# Altium project Copy of MB1363.PrjPcb (part 2 of 2)

## Sheet Copy of MCU_144_POWER.SchDoc: MCU 144 POWER
size A4; Date: Not used; ApprovedBy: Not used; CheckedBy: Not used; Author: Not used; CompanyName: STMicroelectronics; DrawnBy: Not used; Engineer: Not used; Organization: Not used; Address1: Not used; Address2: Not used; Address3: Not used; Address4: Not used; DocumentNumber: 4; Revision: Not used; SheetNumber: 4; SheetTotal: 9; CurrentTime: Not used; CurrentDate: Not used; Time: Not used; DocumentFullPathAndName: Not used; DocumentName: Not used; ModifiedDate: Not used; ImagePath: Not used; ProjectName: Not used; Application_BuildNumber: Not used
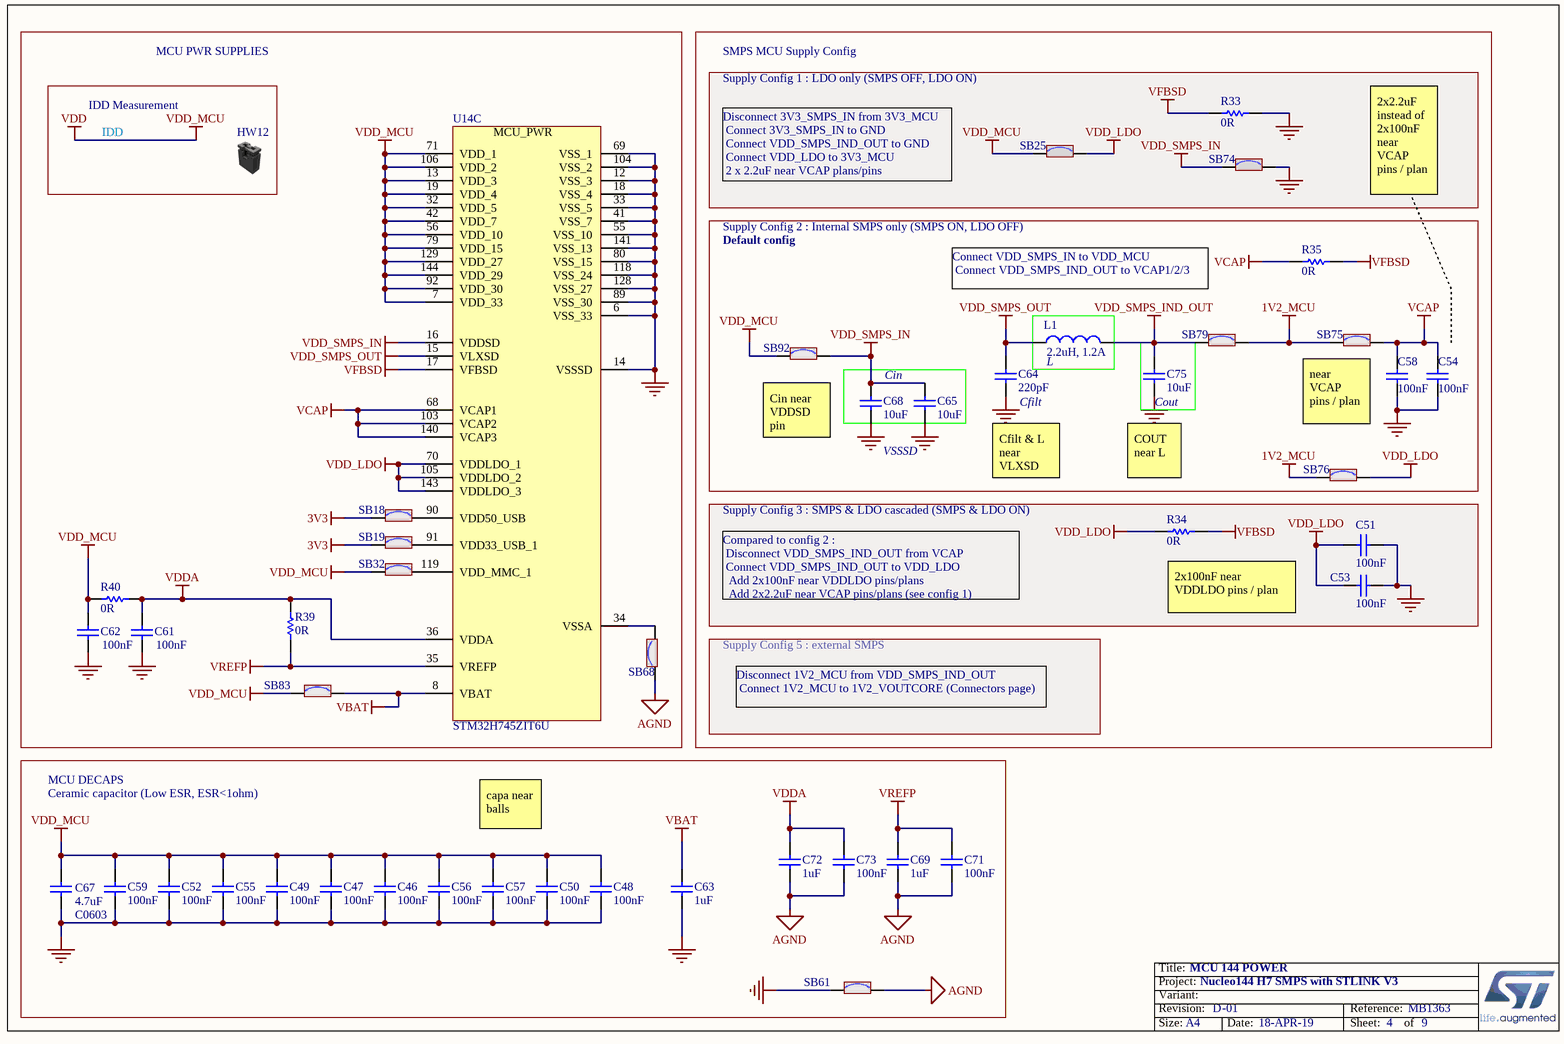
[diagram p5: Copy of MCU_144_POWER.SchDoc]

### Parts
C46  value 100nF  [C0402]  (hidden comment: Capacitor)
C47  value 100nF  [C0402]  (hidden comment: Capacitor)
C48  value 100nF  [C0402]  (hidden comment: Capacitor)
C49  value 100nF  [C0402]  (hidden comment: Capacitor)
C50  value 100nF  [C0402]  (hidden comment: Capacitor)
C51  value 100nF  [C0402]  (hidden comment: Capacitor)
C52  value 100nF  [C0402]  (hidden comment: Capacitor)
C53  value 100nF  [C0402]  (hidden comment: Capacitor)
C54  value 100nF  [C0402]  (hidden comment: Capacitor)
C55  value 100nF  [C0402]  (hidden comment: Capacitor)
C56  value 100nF  [C0402]  (hidden comment: Capacitor)
C57  value 100nF  [C0402]  (hidden comment: Capacitor)
C58  value 100nF  [C0402]  (hidden comment: Capacitor)
C59  value 100nF  [C0402]  (hidden comment: Capacitor)
C61  value 100nF  [C0402]  (hidden comment: Capacitor)
C62  value 100nF  [C0402]  (hidden comment: Capacitor)
C63  value 1uF  [C0603]  (hidden comment: Capacitor)
C64  value 220pF  [C0402]  (hidden comment: Capacitor)
C65  value 10uF  [C0402]  (hidden comment: Capacitor)
C67  value 4.7uF  [C0603]  (hidden comment: Capacitor)
C68  value 10uF  [C0402]  (hidden comment: Capacitor)
C69  value 1uF  [C0603]  (hidden comment: Capacitor)
C71  value 100nF  [C0402]  (hidden comment: Capacitor)
C72  value 1uF  [C0603]  (hidden comment: Capacitor)
C73  value 100nF  [C0402]  (hidden comment: Capacitor)
C75  value 10uF  [C0603]  (hidden comment: Capacitor)
HW12  Shunt Black 2.54mm  (value not drawn)  (mechanical)
L1  value 2.2uH, 1.2A  [L0805_H0P9]  (hidden comment: Inductor)
R33  value 0R  [R0402]  (hidden comment: Resistor)
R34  value 0R  [R0402]  (hidden comment: Resistor)
R35  value 0R  [R0402]  (hidden comment: Resistor)
R39  value 0R  [R0603]  (hidden comment: Resistor)
R40  value 0R  [R0603]  (hidden comment: Resistor)
SB18  SB_ON  [SOLDER-BRIDGE_R0603-0R]  (value not drawn)
SB19  SB_ON  [SOLDER-BRIDGE_R0603-0R]  (value not drawn)
SB25  SB_ON  [SOLDER-BRIDGE_R0603-0R]  (value not drawn)
SB32  SB_ON  [SOLDER-BRIDGE_R0603-0R]  (value not drawn)
SB61  SB_ON  [SOLDER-BRIDGE_R0603-0R]  (value not drawn)
SB68  SB_ON  [SOLDER-BRIDGE_R0603-0R]  (value not drawn)
SB74  SB_ON  [SOLDER-BRIDGE_R0603-0R]  (value not drawn)
SB75  SB_ON  [SOLDER-BRIDGE_R0603-0R]  (value not drawn)
SB76  SB_ON  [SOLDER-BRIDGE_R0603-0R]  (value not drawn)
SB79  SB_ON  [SOLDER-BRIDGE_R0603-0R]  (value not drawn)
SB83  SB_ON  [SOLDER-BRIDGE_R0603-0R]  (value not drawn)
SB92  SB_ON  [SOLDER-BRIDGE_R0603-0R]  (value not drawn)
U14  value STM32H745ZIT6U  [ICC_LQFP144_20X20_P050_SOCKET_YAMAICHI_IC149-144-145-B5_NM]  (hidden comment: STM32H7_LQFP144_SMPS)  (part C of 3)

### Blocks framed on the sheet
L: L1
Cout: C75
Cin: C65 C68
Supply Config 3 : SMPS & LDO cascaded (SMPS & LDO ON): C51 C53 R34

### Nets
1V2_MCU: SB75.2 SB76.2 SB79.1
3V3: C46.2 C47.2 C48.2 C49.2 C50.2 C52.2 C55.2 C56.2 C57.2 C59.2 C62.1 C67.2 R40.1 SB18.2 SB19.2 SB25.2 SB32.2 SB83.1 SB92.2 U14.7(VDD_33) U14.13(VDD_3) U14.19(VDD_4) U14.32(VDD_5) U14.42(VDD_7) U14.56(VDD_10) U14.71(VDD_1) U14.79(VDD_15) U14.92(VDD_30) U14.106(VDD_2) U14.129(VDD_27) U14.144(VDD_29)  [also labelled VDD, VDD_MCU]
AGND: C69.2 C71.1 C72.2 C73.1 SB61.2 SB68.1
GND: C46.1 C47.1 C48.1 C49.1 C50.1 C51.2 C52.1 C53.2 C54.1 C55.1 C56.1 C57.1 C58.1 C59.1 C61.2 C62.2 C63.1 C64.1 C65.1 C67.1 C68.1 C75.1 R33.2 SB61.1 SB74.1 U14.6(VSS_33) U14.12(VSS_3) U14.14(VSSSD) U14.18(VSS_4) U14.33(VSS_5) U14.41(VSS_7) U14.55(VSS_10) U14.69(VSS_1) U14.80(VSS_15) U14.89(VSS_30) U14.104(VSS_2) U14.118(VSS_24) U14.128(VSS_27) U14.141(VSS_13)
VBAT: C63.2 SB83.2 U14.8(VBAT)
VCAP: C54.2 C58.2 R35.1 SB75.1 U14.68(VCAP1) U14.103(VCAP2) U14.140(VCAP3)
VDD_LDO: C51.1 C53.1 R34.1 SB25.1 SB76.1 U14.70(VDDLDO_1) U14.105(VDDLDO_2) U14.143(VDDLDO_3)
VDD_SMPS_IN: C65.2 C68.2 SB74.2 SB92.1 U14.16(VDDSD)
VDD_SMPS_IND_OUT: C75.2 L1.2 SB79.2
VDD_SMPS_OUT: C64.2 L1.1 U14.15(VLXSD)
VDDA: C61.1 C72.1 C73.2 R39.1 R40.2 U14.36(VDDA)
VFBSD: R33.1 R34.2 R35.2 U14.17(VFBSD)
VREFP: C69.1 C71.2 R39.2 U14.35(VREFP)
NetSB18_1: SB18.1 U14.90(VDD50_USB)
NetSB19_1: SB19.1 U14.91(VDD33_USB_1)
NetSB32_1: SB32.1 U14.119(VDD_MMC_1)
NetSB68_2: SB68.2 U14.34(VSSA)

### Notes on the sheet
- IDD Measurement
- MCU PWR SUPPLIES
- SMPS MCU Supply Config
- Supply Config 1 : LDO only (SMPS OFF, LDO ON)
- IDD
- Disconnect 3V3_SMPS_IN from 3V3_MCU
  Connect 3V3_SMPS_IN to GND
  Connect VDD_SMPS_IND_OUT to GND
  Connect VDD_LDO to 3V3_MCU
  2 x 2.2uF near VCAP plans/pins
- Default config
- Supply Config 2 : Internal SMPS only (SMPS ON, LDO OFF)
- 2x2.2uF instead of 2x100nF near VCAP pins / plan
- Connect VDD_SMPS_IN to VDD_MCU
  Connect VDD_SMPS_IND_OUT to VCAP1/2/3
- Cin near VDDSD pin
- (near C64) Cfilt
- near VCAP pins / plan
- VSSSD
- (near C64) Cfilt & L near VLXSD pin
- COUT near L
- Supply Config 5 : external SMPS
- Compared to config 2 :
  Disconnect VDD_SMPS_IND_OUT from VCAP
  Connect VDD_SMPS_IND_OUT to VDD_LDO
  Add 2x100nF near VDDLDO pins/plans
  Add 2x2.2uF near VCAP pins/plans (see config 1)
- (near R34) 2x100nF near VDDLDO pins / plan
- Disconnect 1V2_MCU from VDD_SMPS_IND_OUT
  Connect 1V2_MCU to 1V2_VOUTCORE (Connectors page)
- MCU DECAPS
- Ceramic capacitor (Low ESR, ESR<1ohm)
- capa near balls
- Title:
- Project:
- Size:
- Revision:
- Variant:
- A4
- -
- Date:
- Reference:
- Sheet:
- of
- (in symbol MCD-01401, part C) MCU_PWR

### Library data of the parts
C46-C59 C61 C62 C71 C73 = MCD-00006: Capacitor, MLCC, 100nF, 16V, X7R, 10%, 0402, T=0.5mm; Manufacturer_Part_Number: CC0402KRX7R7BB104; Manufacturer: YAGEO; Alternate_Manufacturer_Part_Number: GCM155R71C104KA55D; Alternate_Manufacturer: MURATA; Provided_By: SUBCO; ECCN_US: EAR99; ECCN_EU: NEC; Internal_Part_Number: MCD-00006; Status: Released; Part_Type: Capacitor; Package: C0402; ComponentLink1Description: Datasheet; ComponentLink1URL: http://tunmcdsvn.tun.st.com/Component_Datasheet_Library/Trunk/Capacitors/Yageo_Multilayer_Capacitor_X7R_series_100pF_to_22uF
C63 C69 C72 = MCD-00238: Capacitor, MLCC, 1uF, 6V3, X5R, 10%, 0603, T=0,8mm; Manufacturer_Part_Number: CC0603KRX5R5BB105; Manufacturer: YAGEO; Provided_By: SUBCO; ECCN_US: EAR99; ECCN_EU: NEC; Internal_Part_Number: MCD-00238; Status: Released; Part_Type: Capacitor; Package: C0603; ComponentLink1Description: Datasheet; ComponentLink1URL: http://tunmcdsvn.tun.st.com/Component_Datasheet_Library/Trunk/Capacitors/Yageo_Multilayer_capacitor_X5R_series_100pF_to_100uF
C64 = MCD-01225: Capacitor, MLCC, 220pF, 50V, NPO, 5%, 0402, T=0,5mm; Manufacturer_Part_Number: CC0402JRNPO9BN221; Manufacturer: YAGEO; Provided_By: SUBCO; Internal_Part_Number: MCD-01225; Status: Released; Part_Type: Capacitor; Package: C0402; ComponentLink1Description: Datasheet; ComponentLink1URL: http://tunmcdsvn.tun.st.com/Component_Datasheet_Library/Trunk/Capacitors/Yageo_Capacitor_NP0_16V-to-50V; ECCN_US: N/A; ECCN_EU: N/A
C65 C68 = MCD-01716: Capacitor, MLCC, 10uF, 6V3, X5R, 20%, 0402, T=0.5mm; Manufacturer_Part_Number: CC0402MRX5R5BB106; Manufacturer: YAGEO; Provided_By: SUBCO; Internal_Part_Number: MCD-01716; Status: Released; Part_Type: Capacitor; Package: C0402; ComponentLink1Description: Datasheet; ComponentLink1URL: http://tunmcdsvn.tun.st.com/Component_Datasheet_Library/Trunk/Capacitors/Yageo_Multilayer_capacitor_X5R_series_100pF_to_100uF/Yageo_Multilayer_capacitor_X5R_100pF_to_100uF.pdf; ECCN_US: N/A; ECCN_EU: N/A
C67 = MCD-01121: Capacitor, MLCC, 4.7µF, 10V, X5R, 20%, 0603, T=0,8mm; Manufacturer_Part_Number: GRM188R61A475ME15; Manufacturer: MURATA; Provided_By: SUBCO; ECCN_US: EAR99; ECCN_EU: NEC; Internal_Part_Number: MCD-01121; Status: Released; Part_Type: Capacitor; Package: C0603; ComponentLink1Description: Datasheet; ComponentLink1URL: http://tunmcdsvn.tun.st.com/Component_Datasheet_Library/Trunk/Capacitors/Murata_Capacitor_GR_series
C75 = MCD-01341: Capacitor, MLCC, 10uF, 6V3, X5R, 20%, 0603, T=0,8mm; Manufacturer_Part_Number: GRM188R60J106ME47D; Manufacturer: MURATA; Provided_By: SUBCO; ECCN_US: EAR99; ECCN_EU: NEC; Internal_Part_Number: MCD-01341; Status: Released; Part_Type: Capacitor; Package: C0603; ComponentLink1Description: Datasheet; ComponentLink1URL: http://tunmcdsvn.tun.st.com/Component_Datasheet_Library/Trunk/Capacitors/Murata_Capacitor_GR_series
HW12 = MCD-00043: SHUNT 2.54mm BLACK; Manufacturer_Part_Number: SNT-100-BK-G; Manufacturer: SAMTEC; Part_Type: Mechanical; Alternate_Manufacturer_Part_Number: 316102S111A; Alternate_Manufacturer: JIUBABA; Provided_By: SUBCO; Internal_Part_Number: MCD-00043; ComponentLink1Description: Datasheet; Status: Released; ComponentLink1URL: http://tunmcdsvn.tun.st.com/Component_Datasheet_Library/Trunk/Connectors/Samtec_Shunt_Jumper_SNT100; ECCN_US: n/a; ECCN_EU: n/a
L1 = MCD-01340: Inductor, 2.2uH, 20%, Isat 1.2A, DCR 0.228Ohm, 0805; Manufacturer_Part_Number: DFE201210U-2R2M=P2; Manufacturer: MURATA; Provided_By: SUBCO; Internal_Part_Number: MCD-01340; Status: Released; Part_Type: Inductor; Package: L0805; ComponentLink1Description: Datasheet; ComponentLink1URL: http://tunmcdsvn.tun.st.com/Component_Datasheet_Library/Trunk/Inductors/MURATA_Power_Inductor_2u2H_2012_DFE201210U-2R2M=P2; ECCN_US: n/a; ECCN_EU: n/a
R33-R35 = MCD-00052: Resistor,0R,0402,5%,1/16W; Manufacturer_Part_Number: RC0402JR-070RL; Manufacturer: YAGEO; Provided_By: SUBCO; ECCN_US: EAR99; ECCN_EU: NEC; Internal_Part_Number: MCD-00052; Status: Released; Part_Type: Resistor; Package: R0402; ComponentLink1Description: Datasheet; ComponentLink1URL: http://tunmcdsvn.tun.st.com/Component_Datasheet_Library/Trunk/Resistors/Yageo_Resistor_RC0402-series
R39 R40 = MCD-00056: Resistor,0R,0603,5%,1/10W; Manufacturer_Part_Number: RC0603JR-070RL; Manufacturer: YAGEO; Provided_By: SUBCO; ECCN_US: EAR99; ECCN_EU: NEC; Internal_Part_Number: MCD-00056; ComponentLink1Description: Datasheet; Status: Released; Part_Type: Resistor; ComponentLink1URL: http://tunmcdsvn.tun.st.com/Component_Datasheet_Library/Trunk/Resistors/Yageo_Resistor_RC0603-series; Package: R0603
SB18 SB19 SB25 SB32 SB61 SB68 SB74-SB76 SB79 SB83 SB92 = MCD-00071: as SB54 on sheet Copy of Connectors; Internal_Part_Number: MCD-00071; Status: Released; ComponentLink1Description: Datasheet; Package: SB0603; ComponentLink1URL: http://tunmcdsvn.tun.st.com/Component_Datasheet_Library/Trunk/Resistors/Yageo_Resistor_RC0603-series; ECCN_US: n/a; ECCN_EU: n/a
U14 = MCD-01401: STM32H745ZIT6U, LQFP144 package, 20x20, with socket footprint; Part_Type: IC; Manufacturer: STMICROELECTRONICS; BMS_Part_Number: 9175297 (cut 2.0); ECCN_US: 3A991A2; ECCN_EU: NEC; Provided_By: SUBCO with ST control; Internal_Part_Number: MCD-01401; Status: Released; Manufacturer_Part_Number: STM32H745ZIT6U; Package: LQFP144 20x20; ComponentLink1Description: Datasheet; ComponentLink1URL: http://tunmcdsvn.tun.st.com/Component_Datasheet_Library/Trunk/IC/STM_STM32L552ZET6QU

## Sheet USB.SchDoc: USB
size A4; Date: Not used; ApprovedBy: Not used; CheckedBy: Not used; Author: Not used; CompanyName: STMicroelectronics; DrawnBy: Not used; Engineer: Not used; Organization: Not used; Address1: Not used; Address2: Not used; Address3: Not used; Address4: Not used; DocumentNumber: 7; Revision: Not used; SheetNumber: 7; SheetTotal: 9; CurrentTime: Not used; CurrentDate: Not used; Time: Not used; DocumentFullPathAndName: Not used; DocumentName: Not used; ModifiedDate: Not used; ImagePath: Not used; ProjectName: Not used; Application_BuildNumber: Not used
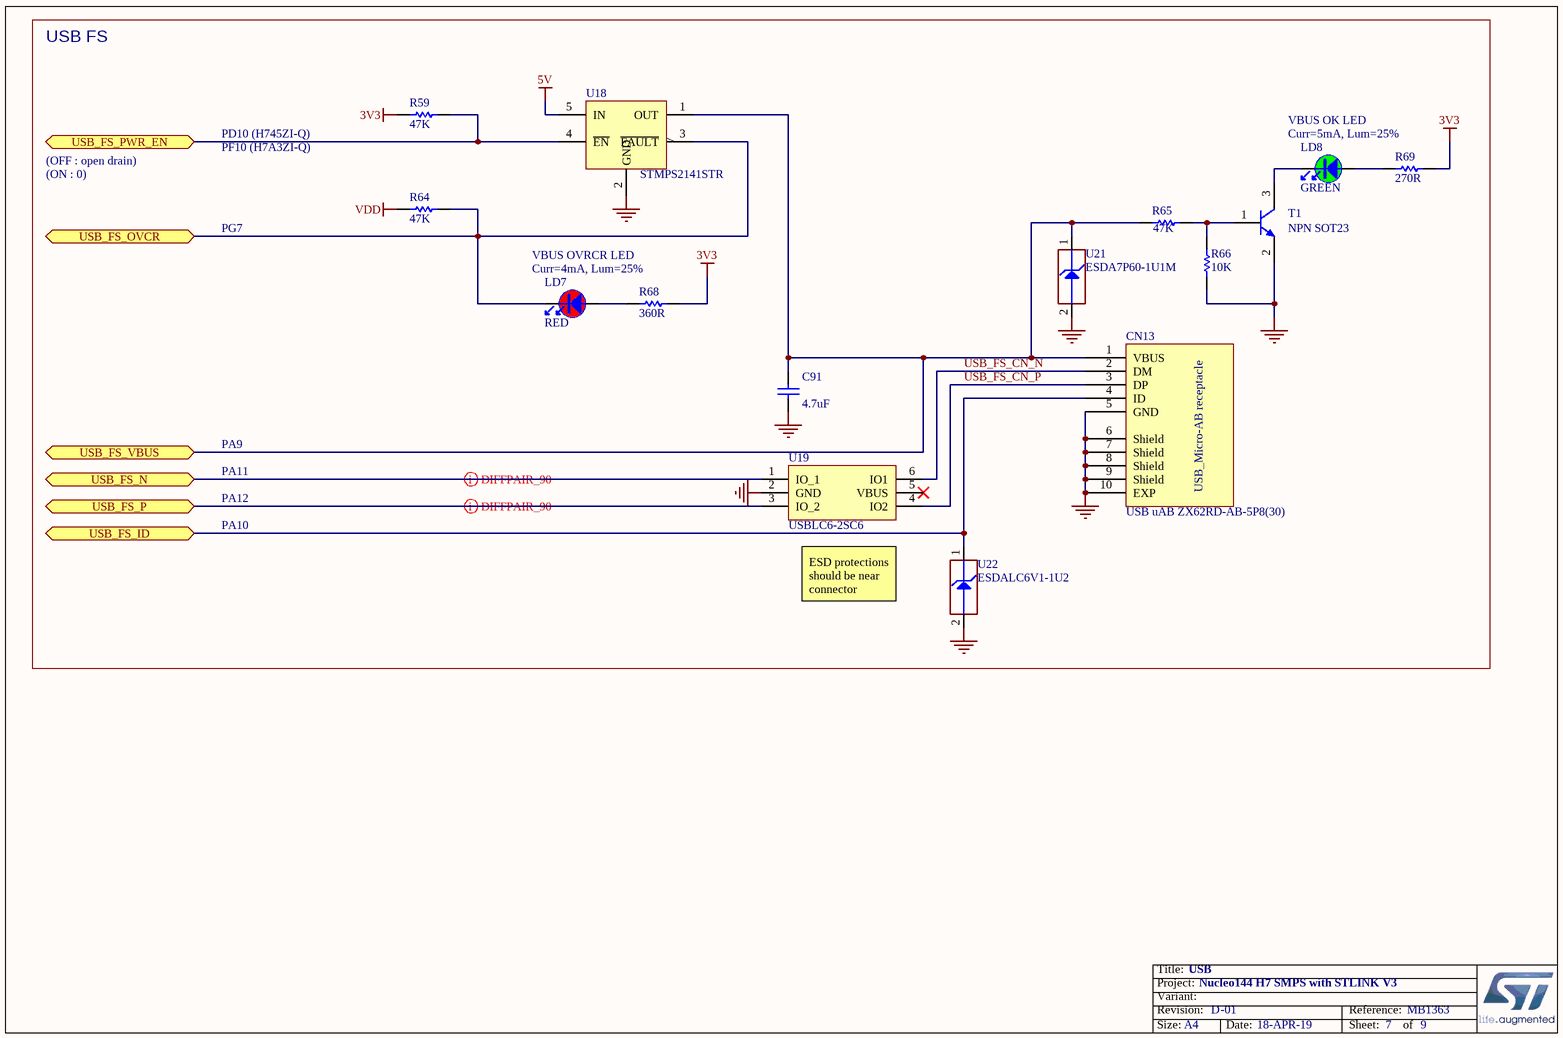
[diagram p6: USB.SchDoc]

### Parts
C91  value 4.7uF  [C0603]  (hidden comment: Capacitor)
CN13  value USB uAB ZX62RD-AB-5P8(30)  [CON_USBMICROAB_MOLEX_47590-0001_H3]  (hidden comment: USB_uAB_47590.0001)
LD7  value RED  [LED_0603_VISHAY_VLMS1300-GS08_RED_1A2K_H0P8]  (hidden comment: LED_red)
LD8  value GREEN  [LED_0603_OSRAM_LG-Q396-PS-35_GREEN_1A2K_H0P4]  (hidden comment: LED_green)
R59  value 47K  [R0402]  (hidden comment: Resistor)
R64  value 47K  [R0402]  (hidden comment: Resistor)
R65  value 47K  [R0402]  (hidden comment: Resistor)
R66  value 10K  [R0402]  (hidden comment: Resistor)
R68  value 360R  [R0402]  (hidden comment: Resistor)
R69  value 270R  [R0402]  (hidden comment: Resistor)
T1  value NPN SOT23  [NPN_SOT23]  (hidden comment: 9013-SOT23)
U18  STMPS2141STR  [MOS_SOT23-5L]
U19  USBLC6-2SC6  [ESD_SOT23-6L]
U21  value ESDA7P60-1U1M  [ESD_QFN2_1P6X1_P125]  (hidden comment: ESD-TRANSIL)
U22  value ESDALC6V1-1U2  [ESD_ST0201]  (hidden comment: ESD-TRANSIL)

### Ports
USB_FS_ID, USB_FS_N, USB_FS_OVCR, USB_FS_P, USB_FS_PWR_EN, USB_FS_VBUS

### Nets
3V3: R59.2 R64.2 R68.2 R69.2  [also labelled VDD]
5V: U18.5(IN)
GND: C91.1 CN13.5(GND) CN13.6(Shield) CN13.7(Shield) CN13.8(Shield) CN13.9(Shield) CN13.10(EXP) R66.1 T1.2(E) U18.2(GND) U19.2(GND) U21.2(GND) U22.2(GND)
USB_FS_CN_N: CN13.2(DM) U19.6(IO1)
USB_FS_CN_P: CN13.3(DP) U19.4(IO2)
USB_FS_ID: CN13.4(ID) U22.1(IO1) ; port USB_FS_ID
USB_FS_N: U19.1(IO_1) ; port USB_FS_N
USB_FS_OVCR: LD7.2 R64.1 U18.3(~{FAULT}) ; port USB_FS_OVCR
USB_FS_P: U19.3(IO_2) ; port USB_FS_P
USB_FS_PWR_EN: R59.1 U18.4(~{EN}) ; port USB_FS_PWR_EN
USB_FS_VBUS: C91.2 CN13.1(VBUS) R65.1 U18.1(OUT) U21.1(IO1) ; port USB_FS_VBUS
NetLD7_1: LD7.1 R68.1
NetLD8_1: LD8.1 R69.1
NetLD8_2: LD8.2 T1.3(C)
NetR65_2: R65.2 R66.2 T1.1(B)

Not connected (* = marked no-connect by the designer): U19 5(VBUS)*

### Layout directives
differential pair: USB_FS_N, USB_FS_P

### Notes on the sheet
- USB FS
- (OFF : open drain)
- (ON : 0)
- PD10 (H745ZI-Q)
- PF10 (H7A3ZI-Q)
- VBUS OK LED
- Curr=5mA, Lum=25%
- PG7
- VBUS OVRCR LED
- Curr=4mA, Lum=25%
- PA9
- PA11
- PA12
- PA10
- (near U19) ESD protections should be near connector
- Title:
- Project:
- Size:
- Revision:
- Variant:
- A4
- -
- Date:
- Reference:
- Sheet:
- of
- (in symbol MCD-00661) USB_Micro-AB receptacle

### Library data of the parts
C91 = MCD-00009: Capacitor, MLCC, 4.7uF, 16V, X5R, 10%, 0603, T=0.8mm; Manufacturer_Part_Number: CC0603KRX5R7BB475; Manufacturer: YAGEO; Provided_By: SUBCO; ECCN_US: EAR99; ECCN_EU: NEC; Internal_Part_Number: MCD-00009; ComponentLink1Description: Datasheet; Status: Released; Package: C0603; Part_Type: Capacitor; ComponentLink1URL: http://tunmcdsvn.tun.st.com/Component_Datasheet_Library/Trunk/Capacitors/Yageo_Multilayer_capacitor_X5R_series_100pF_to_100uF
CN13 = MCD-00661: USB-MICRO-AB Receptacle, RA, SMT + DIP, Standard, Top Mount, USB certified (symbol & footprint compatible with MCD-00022); Part_Type: Connector; Manufacturer_Part_Number: ZX62RD-AB-5P8(30); Manufacturer: HIROSE; Provided_By: SUBCO; Internal_Part_Number: MCD-00661; Status: Checked; ComponentLink1Description: Datasheet; ComponentLink1URL: http://tunmcdsvn.tun.st.com/Component_Datasheet_Library/Trunk/Connectors/Hirose_ZX_catalog-939768; ECCN_US: n/a; ECCN_EU: n/a
LD7 = MCD-00587: LED Red, 0603 SMD, 2V Forward Voltage; Part_Type: Display; Manufacturer_Part_Number: VLMS1300-GS08; Manufacturer: VISHAY; Alternate_Manufacturer_Part_Number: LS Q976-NR-1; Alternate_Manufacturer: OSRAM OPTO SEMICONDUCTORS; Provided_By: SUBCO; Internal_Part_Number: MCD-00587; Status: Released; Package: LED 0603; ComponentLink1Description: Datasheet; ComponentLink1URL: http://tunmcdsvn.tun.st.com/Component_Datasheet_Library/Trunk/Display/VISHAY_LED_RED_VLMS1300-GS08; Order_Code_Digikey: VLMS1300-GS08CT-ND; Order_Code_Farnell: 2078728; ECCN_US: n/a; ECCN_EU: n/a
LD8 = MCD-00588: LED Green, 0603 SMD, Forward Voltage Typ=2V, Max=2.5V; Part_Type: Display; Manufacturer_Part_Number: LG Q396-PS-35; Manufacturer: OSRAM OPTO SEMICONDUCTORS; Alternate_Manufacturer_Part_Number: VLMTG1300-GS08; Alternate_Manufacturer: VISHAY SEMICONDUCTOR OPTO DIVISION; Provided_By: SUBCO; Internal_Part_Number: MCD-00588; Status: Released; Package: LED 0603; ComponentLink1Description: Datasheet; ComponentLink1URL: http://tunmcdsvn.tun.st.com/Component_Datasheet_Library/Trunk/Display/OSRAM_LED_GREEN_LG Q396-PS-35; Order_Code_Digikey: LG Q396-PS-35-ND; ECCN_US: n/a; ECCN_EU: n/a
R59 R64 R65 = MCD-00063: Resistor,47K,0402,1%,1/16W; Manufacturer_Part_Number: RC0402FR-0747KL; Manufacturer: YAGEO; Provided_By: SUBCO; ECCN_US: EAR99; ECCN_EU: NEC; Internal_Part_Number: MCD-00063; ComponentLink1Description: Datasheet; Status: Released; Part_Type: Resistor; Package: R0402; ComponentLink1URL: http://tunmcdsvn.tun.st.com/Component_Datasheet_Library/Trunk/Resistors/Yageo_Resistor_RC0402-series
R66 = MCD-00053: as R25 on sheet Copy of Power_Board; Internal_Part_Number: MCD-00053; Status: Released; ComponentLink1Description: Datasheet; Part_Type: Resistor; Package: R0402; ComponentLink1URL: http://tunmcdsvn.tun.st.com/Component_Datasheet_Library/Trunk/Resistors/Yageo_Resistor_RC0402-series
R68 = MCD-00461: Resistor,360R,0402,1%,1/16W; Manufacturer_Part_Number: RC0402FR-07360RL; Manufacturer: YAGEO; Provided_By: SUBCO; ECCN_US: EAR99; ECCN_EU: NEC; Internal_Part_Number: MCD-00461; Status: Released; Part_Type: Resistor; Package: R0402; ComponentLink1Description: Datasheet; ComponentLink1URL: http://tunmcdsvn.tun.st.com/Component_Datasheet_Library/Trunk/Resistors/Yageo_Resistor_RC0402-series
R69 = MCD-00441: as R28 on sheet Copy of Connectors; Internal_Part_Number: MCD-00441; Status: Released; Part_Type: Resistor; Package: R0402; ComponentLink1Description: Datasheet; ComponentLink1URL: http://tunmcdsvn.tun.st.com/Component_Datasheet_Library/Trunk/Resistors/Yageo_Resistor_RC0402-series
T1 = MCD-00073: NPN Bipolar Transistor; Manufacturer_Part_Number: BSR14; Manufacturer: ON SEMICONDUCTOR; Part_Type: IC; Alternate_Manufacturer_Part_Number: MMBT2222LT1G / MMBT2222ALT1G / MMBT2222ALT3G; Provided_By: SUBCO; ECCN_US: EAR99; ECCN_EU: NEC; Revision: *; Internal_Part_Number: MCD-00073; ComponentLink1Description: Datasheet; Status: Released; ComponentLink1URL: http://tunmcdsvn.tun.st.com/Component_Datasheet_Library/Trunk/IC/NXP_Transistor_BSR14; Alternate_Manufacturer: ON SEMICONDUCTOR; Package: SOT23
U18 = MCD-00083: Enhanced single channel power switches with active low enable pin; Part_Type: IC; Manufacturer: STMICROELECTRONICS; Alternate_Manufacturer_Part_Number: TPS2041C; Alternate_Manufacturer: TEXAS INSTRUMENTS; BMS_Part_Number: 9159003; Provided_By: SUBCO with ST control; ECCN_US: EAR99; ECCN_EU: NEC; Internal_Part_Number: MCD-00083; Value: STMPS2141STR; Status: Released; Manufacturer_Part_Number: STMPS2141STR; ComponentLink1Description: Datasheet; ComponentLink1URL: http://tunmcdsvn.tun.st.com/Component_Datasheet_Library/Trunk/IC/STM_PWR-Switch_STMPS2141STR
U19 = MCD-00163: Very low capacitance ESD protection; Part_Type: IC; Manufacturer: STMICROELECTRONICS; BMS_Part_Number: 9151075; Provided_By: SUBCO with ST control; ECCN_US: EAR99; ECCN_EU: NEC; Internal_Part_Number: MCD-00163; Value: USBLC6-2SC6; Status: Released; Manufacturer_Part_Number: USBLC6-2SC6; ComponentLink1Description: Datasheet; ComponentLink1URL: http://tunmcdsvn.tun.st.com/Component_Datasheet_Library/Trunk/Diodes/STM_ESD_USBLC6-2
U21 = MCD-00251: High power transient voltage suppressor, 7V breakdown; Part_Type: Diode; Manufacturer: STMICROELECTRONICS; BMS_Part_Number: 9179042; Provided_By: SUBCO with ST control; ECCN_US: EAR99; ECCN_EU: NEC; Internal_Part_Number: MCD-00251; Status: Released; Manufacturer_Part_Number: ESDA7P60-1U1M; ComponentLink1Description: Datasheet; ComponentLink1URL: http://tunmcdsvn.tun.st.com/Component_Datasheet_Library/Trunk/Diodes/STM_ESD_ESDA7P60-1U1M
U22 = MCD-00170: ESD protection 6V1; Part_Type: Diode; Manufacturer: STMICROELECTRONICS; BMS_Part_Number: 9151132; Provided_By: SUBCO with ST control; ECCN_US: EAR99; ECCN_EU: NEC; Internal_Part_Number: MCD-00170; Status: Released; Manufacturer_Part_Number: ESDALC6V1-1U2; ComponentLink1Description: Datasheet; ComponentLink1URL: http://tunmcdsvn.tun.st.com/Component_Datasheet_Library/Trunk/Diodes/STM_ESD_ESDALC6V1-1U2

## Sheet Ethernet.SchDoc: Ethernet PHY with RJ45 connector
size A4; Date: Not used; ApprovedBy: Not used; CheckedBy: Not used; Author: Not used; CompanyName: STMicroelectronics; DrawnBy: Not used; Engineer: Not used; Organization: Not used; Address1: Not used; Address2: Not used; Address3: Not used; Address4: Not used; DocumentNumber: 6; Revision: Not used; SheetNumber: 6; SheetTotal: 9; Time: Not used; ImagePath: Not used; Application_BuildNumber: Not used
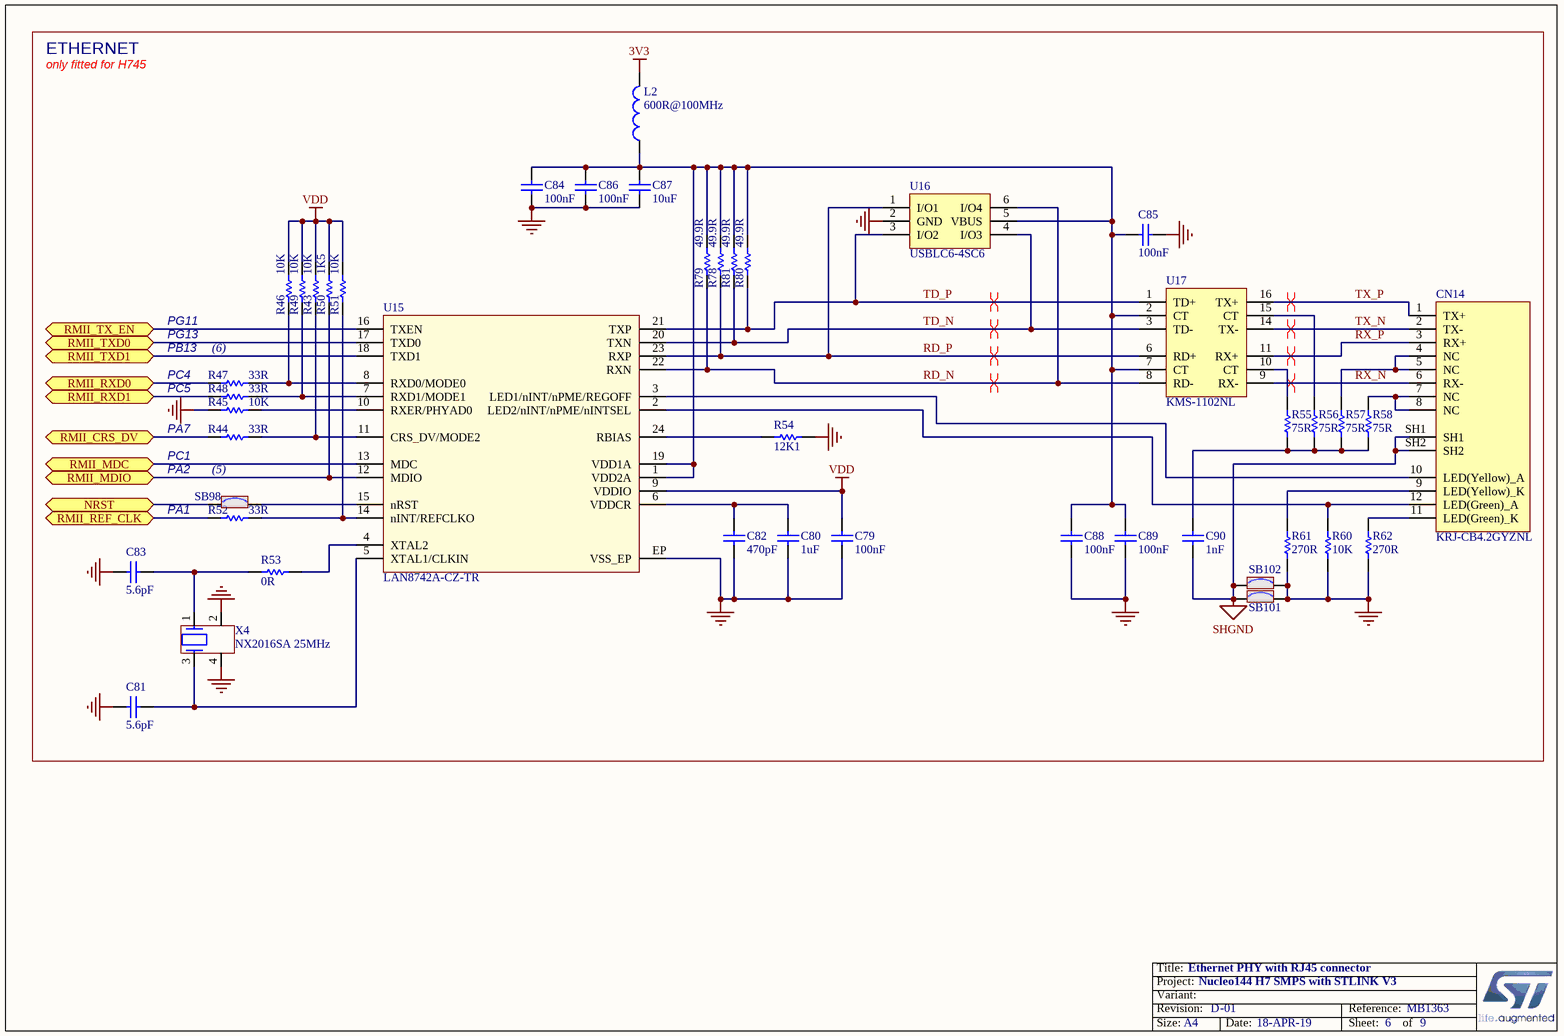
[diagram p7: Ethernet.SchDoc]

### Parts
(Parts that share a designator on the sheet are numbered #1, #2 ... from top to bottom, then left to right.)
C79  value 100nF  [C0603]  (hidden comment: Capacitor)
C80  value 1uF  [C0402]  (hidden comment: Capacitor)
C81  value 5.6pF  [C0402]  (hidden comment: Capacitor)
C82  value 470pF  [C0402]  (hidden comment: Capacitor)
C83  value 5.6pF  [C0402]  (hidden comment: Capacitor)
C84  value 100nF  [C0603]  (hidden comment: Capacitor)
C85  value 100nF  [C0603]  (hidden comment: Capacitor)
C86  value 100nF  [C0603]  (hidden comment: Capacitor)
C87  value 10uF  [C0603]  (hidden comment: Capacitor)
C88  value 100nF  [C0603]  (hidden comment: Capacitor)
C89  value 100nF  [C0603]  (hidden comment: Capacitor)
C90  value 1nF  [C1206_H1P6]  (hidden comment: Capacitor)
CN14  value KRJ-CB4.2GYZNL  [CON_RJ45_DGKYD_KRJ-CB4.2GYZNL]  (hidden comment: RJ45_KRJ-CB4.2GYZNL)
L2  value 600R@100MHz  [L0603]  (hidden comment: BEAD)
R43  value 10K  [R0402]  (hidden comment: Resistor)
R44  value 33R  [R0402]  (hidden comment: Resistor)
R45  value 10K  [R0402]  (hidden comment: Resistor)
R46  value 10K  [R0402]  (hidden comment: Resistor)
R47  value 33R  [R0402]  (hidden comment: Resistor)
R48  value 33R  [R0402]  (hidden comment: Resistor)
R49  value 10K  [R0402]  (hidden comment: Resistor)
R50  value 1K5  [R0402]  (hidden comment: Resistor)
R51  value 10K  [R0402]  (hidden comment: Resistor)
R52  value 33R  [R0402]  (hidden comment: Resistor)
R53  value 0R  [R0402]  (hidden comment: Resistor)
R54  value 12K1  [R0402]  (hidden comment: Resistor)
R55  value 75R  [R0402]  (hidden comment: Resistor)
R56  value 75R  [R0402]  (hidden comment: Resistor)
R57  value 75R  [R0402]  (hidden comment: Resistor)
R58  value 75R  [R0402]  (hidden comment: Resistor)
R60  value 10K  [R0402]  (hidden comment: Resistor)
R61  value 270R  [R0402]  (hidden comment: Resistor)
R62  value 270R  [R0402]  (hidden comment: Resistor)
R78  value 49.9R  [R0402]  (hidden comment: Resistor)
R79  value 49.9R  [R0402]  (hidden comment: Resistor)
R80  value 49.9R  [R0402]  (hidden comment: Resistor)
R81  value 49.9R  [R0402]  (hidden comment: Resistor)
SB98  SB_ON  [SOLDER-BRIDGE_R0603-0R]  (value not drawn)
SB101  SB_ON  [SOLDER-BRIDGE_R0603-0R]  (value not drawn)
SB102  SB_ON  [SOLDER-BRIDGE_R0603-0R]  (value not drawn)
U15#1  LAN8742A-CZ-TR  [ICC_VQFN24-EPAD_4X4_P050]
U16  USBLC6-4SC6  [ESD_SOT23-6L]
U17  KMS-1102NL  [TRS_DGKYD_KMS-1102NL]
X4  value NX2016SA 25MHz  [CRY_NX2016SA_4P]  (hidden comment: XTAL_4_PINS)

### Ports
NRST (bidir), RMII_CRS_DV (bidir), RMII_MDC (bidir), RMII_MDIO (bidir), RMII_REF_CLK (bidir), RMII_RXD0 (bidir), RMII_RXD1 (bidir), RMII_TX_EN (bidir), RMII_TXD0 (bidir), RMII_TXD1 (bidir)

### Nets
3V3: C79.2 L2.2 R43.2 R46.2 R49.2 R50.2 R51.2 U15#1.9(VDDIO)  [also labelled VDD]
GND: C79.1 C80.1 C81.1 C82.1 C83.1 C84.1 C85.2 C86.1 C87.1 C88.1 C89.1 R45.2 R54.2 R60.1 R61.1 R62.1 SB101.2 SB102.2 U15#1.EP(VSS_EP) U16.2(GND) X4.2 X4.4
SHGND: C90.1 CN14.SH1 CN14.SH2 SB101.1 SB102.1
CPU_RST: SB98.1 ; port NRST
RD_N: R79.1 U15#1.22(RXN) U16.6(I/O4) U17.8(RD-)
RD_P: R78.1 U15#1.23(RXP) U16.1(I/O1) U17.6(RD+)
RMII_CRS_DV: R44.1 ; port RMII_CRS_DV
RMII_MDC: U15#1.13(MDC) ; port RMII_MDC
RMII_MDIO: R50.1 U15#1.12(MDIO) ; port RMII_MDIO
RMII_REF_CLK: R52.1 ; port RMII_REF_CLK
RMII_RXD0: R47.1 ; port RMII_RXD0
RMII_RXD1: R48.1 ; port RMII_RXD1
RMII_TX_EN: U15#1.16(TXEN) ; port RMII_TX_EN
RMII_TXD0: U15#1.17(TXD0) ; port RMII_TXD0
RMII_TXD1: U15#1.18(TXD1) ; port RMII_TXD1
RX_N: CN14.6(RX-) U17.9(RX-)
RX_P: CN14.3(RX+) U17.11(RX+)
TD_N: R81.1 U15#1.20(TXN) U16.4(I/O3) U17.3(TD-)
TD_P: R80.1 U15#1.21(TXP) U16.3(I/O2) U17.1(TD+)
TX_N: CN14.2(TX-) U17.14(TX-)
TX_P: CN14.1(TX+) U17.16(TX+)
NetC80_2: C80.2 C82.2 U15#1.6(VDDCR)
NetC81_2: C81.2 U15#1.5(XTAL1/CLKIN) X4.3
NetC83_2: C83.2 R53.1 X4.1
NetC84_2: C84.2 C85.1 C86.2 C87.2 C88.2 C89.2 L2.1 R78.2 R79.2 R80.2 R81.2 U15#1.1(VDD2A) U15#1.19(VDD1A) U16.5(VBUS) U17.2(CT) U17.7(CT)
NetC90_2: C90.2 R55.1 R56.1 R57.1 R58.1
NetCN14_4: CN14.4(NC) CN14.5(NC) R57.2
NetCN14_7: CN14.7(NC) CN14.8(NC) R58.2
NetCN14_9: CN14.9(LED(Yellow)_K) R61.2
NetCN14_10: CN14.10(LED(Yellow)_A) U15#1.3(LED1/nINT/nPME/REGOFF)
NetCN14_11: CN14.11(LED(Green)_K) R62.2
NetCN14_12: CN14.12(LED(Green)_A) R60.2 U15#1.2(LED2/nINT/nPME/nINTSEL)
NetR43_1: R43.1 R44.2 U15#1.11(CRS_DV/MODE2)
NetR45_1: R45.1 U15#1.10(RXER/PHYAD0)
NetR46_1: R46.1 R47.2 U15#1.8(RXD0/MODE0)
NetR48_2: R48.2 R49.1 U15#1.7(RXD1/MODE1)
NetR51_1: R51.1 R52.2 U15#1.14(nINT/REFCLKO)
NetR53_2: R53.2 U15#1.4(XTAL2)
NetR54_1: R54.1 U15#1.24(RBIAS)
NetR55_2: R55.2 U17.10(CT)
NetR56_2: R56.2 U17.15(CT)
NetSB98_2: SB98.2 U15#1.15(nRST)

### Layout directives
differential pair: RD_N, RD_P, RX_N, RX_P, TD_N, TD_P, TX_N, TX_P

### Notes on the sheet
- ETHERNET
- only fitted for H745
- PG11
- PG13
- PB13
- PC4
- (6)
- PC5
- PA7
- PC1
- PA2
- PA1
- (5)
- Title:
- Project:
- Size:
- Revision:
- Variant:
- A4
- -
- Date:
- Reference:
- Sheet:
- of

### Library data of the parts
C79 C84-C86 C88 C89 = MCD-00237: Capacitor, MLCC, 100nF, 6V3, X5R, 10%, 0603, T=0,8mm; Manufacturer_Part_Number: CC0603KRX5R5BB104; Manufacturer: YAGEO; Provided_By: SUBCO; ECCN_US: EAR99; ECCN_EU: NEC; Internal_Part_Number: MCD-00237; Status: Released; Part_Type: Capacitor; Package: C0603; ComponentLink1Description: Datasheet; ComponentLink1URL: http://tunmcdsvn.tun.st.com/Component_Datasheet_Library/Trunk/Capacitors/Yageo_Multilayer_capacitor_X5R_series_100pF_to_100uF
C80 = MCD-00095: Capacitor, MLCC, 1uF, 6V3, X5R, 10%, 0402, T=0,5mm; Manufacturer_Part_Number: GRM155R61E105KA12; Manufacturer: MURATA; Alternate_Manufacturer_Part_Number: GRM155R60J105KE19; Provided_By: SUBCO; ECCN_US: EAR99; ECCN_EU: NEC; Internal_Part_Number: MCD-00095; Status: Released; Part_Type: Capacitor; Package: C0402; ComponentLink1Description: Datasheet; ComponentLink1URL: http://tunmcdsvn.tun.st.com/Component_Datasheet_Library/Trunk/Capacitors/Murata_Capacitor_GR_series; Alternate_Manufacturer: MURATA
C81 C83 = MCD-01374: Capacitor, MLCC, 5.6pF, 50V, NPO, 5%, 0402, T=0,5mm; Manufacturer_Part_Number: CC0402BRNPO9BN5R6; Manufacturer: YAGEO; Provided_By: SUBCO; Internal_Part_Number: MCD-01374; Status: Released; Part_Type: Capacitor; Package: C0402; ComponentLink1Description: Datasheet; ComponentLink1URL: http://tunmcdsvn.tun.st.com/Component_Datasheet_Library/Trunk/Capacitors/Yageo_Capacitor_NP0_16V-to-50V; ECCN_US: N/A; ECCN_EU: N/A
C82 = MCD-00724: Capacitor, MLCC, 470pF, 50V, NPO, 5%, 0402, T=0,5mm; Manufacturer_Part_Number: CC0402JRNPO9BN471; Manufacturer: YAGEO; Provided_By: SUBCO; Internal_Part_Number: MCD-00724; Status: Released; Part_Type: Capacitor; Package: C0402; ComponentLink1Description: Datasheet; ComponentLink1URL: http://tunmcdsvn.tun.st.com/Component_Datasheet_Library/Trunk/Capacitors/Yageo_Capacitor_NP0_16V-to-50V; ECCN_US: N/A; ECCN_EU: N/A
C87 = MCD-01124: Capacitor, MLCC, 10µF, 10V, X5R, 10%, 0603, T=0.8mm; Manufacturer_Part_Number: GRM188R61A106KAAL; Manufacturer: MURATA; Provided_By: SUBCO; ECCN_US: EAR99; ECCN_EU: NEC; Internal_Part_Number: MCD-01124; Status: Released; Part_Type: Capacitor; Package: C0603; ComponentLink1Description: Datasheet; ComponentLink1URL: http://tunmcdsvn.tun.st.com/Component_Datasheet_Library/Trunk/Capacitors/Murata_Capacitor_GR_series
C90 = MCD-00722: Capacitor, MLCC, 1nF, 2KV, X7R, 10%, 1206, T=1,25mm; Manufacturer_Part_Number: CC1206KKX7RDBB102; Manufacturer: YAGEO; Provided_By: SUBCO; Internal_Part_Number: MCD-00722; Status: Released; Part_Type: Capacitor; Package: C1206; ComponentLink1Description: Datasheet; ComponentLink1URL: http://tunmcdsvn.tun.st.com/Component_Datasheet_Library/Trunk/Capacitors/Yageo_Multilayer_Capacitor_NPO_X7R_1KV_to_3KV_10pF_to_33nF/; ECCN_US: N/A; ECCN_EU: N/A
CN14 = MCD-00717: RJ45 jack, single port, with LEDS, Metal shielded dip low profile; Part_Type: Connector; Manufacturer: DONGGUAN KEYOUDA ELECTRONIC TECHNOLOGY; Provided_By: SUBCO; Internal_Part_Number: MCD-00717; Status: Released; Manufacturer_Part_Number: KRJ-CB4.2GYZNL; ComponentLink1Description: Datasheet; ComponentLink1URL: http://tunmcdsvn.tun.st.com/Component_Datasheet_Library/Trunk/Connectors/DGKYD_RJ45_KRJ-CB4.2GYZNL; ECCN_US: n/a; ECCN_EU: n/a
L2 = MCD-00047: SMD Chip ferrite bead, 600R@100MHz +/-25%, 350mA, 500mohm DC, 0603, T=0.8mm; Part_Type: Inductor; Manufacturer_Part_Number: FCM1608KF-601T03; Manufacturer: TAI-TECH; Provided_By: SUBCO; Internal_Part_Number: MCD-00047; Status: Released; ComponentLink1Description: Datasheet; ComponentLink1URL: http://tunmcdsvn.tun.st.com/Component_Datasheet_Library/Trunk/Inductors/TaiTech_Bead_FCM1608_series; ECCN_US: n/a; ECCN_EU: n/a
R43 R45 R46 R49 R51 R60 = MCD-00053: Resistor,10K,0402,1%,1/16W; Manufacturer_Part_Number: RC0402FR-0710KL; Manufacturer: YAGEO; Provided_By: SUBCO; ECCN_US: EAR99; ECCN_EU: NEC; Internal_Part_Number: MCD-00053; Status: Released; Part_Type: Resistor; Package: R0402; ComponentLink1Description: Datasheet; ComponentLink1URL: http://tunmcdsvn.tun.st.com/Component_Datasheet_Library/Trunk/Resistors/Yageo_Resistor_RC0402-series
R44 R47 R48 R52 = MCD-00455: Resistor,33R,0402,1%,1/16W; Manufacturer_Part_Number: RC0402FR-0733RL; Manufacturer: YAGEO; Provided_By: SUBCO; ECCN_US: EAR99; ECCN_EU: NEC; Internal_Part_Number: MCD-00455; Status: Released; Part_Type: Resistor; Package: R0402; ComponentLink1Description: Datasheet; ComponentLink1URL: http://tunmcdsvn.tun.st.com/Component_Datasheet_Library/Trunk/Resistors/Yageo_Resistor_RC0402-series
R50 = MCD-00068: Resistor,1K5,0402,1%,1/16W; Manufacturer_Part_Number: RC0402FR-071K5L; Manufacturer: YAGEO; Provided_By: SUBCO; ECCN_US: EAR99; ECCN_EU: NEC; Internal_Part_Number: MCD-00068; Status: Released; Part_Type: Resistor; Package: R0402; ComponentLink1Description: Datasheet; ComponentLink1URL: http://tunmcdsvn.tun.st.com/Component_Datasheet_Library/Trunk/Resistors/Yageo_Resistor_RC0402-series
R53 = MCD-00052: Resistor,0R,0402,5%,1/16W; Manufacturer_Part_Number: RC0402JR-070RL; Manufacturer: YAGEO; Provided_By: SUBCO; ECCN_US: EAR99; ECCN_EU: NEC; Internal_Part_Number: MCD-00052; Status: Released; Part_Type: Resistor; Package: R0402; ComponentLink1Description: Datasheet; ComponentLink1URL: http://tunmcdsvn.tun.st.com/Component_Datasheet_Library/Trunk/Resistors/Yageo_Resistor_RC0402-series
R54 = MCD-00723: Resistor,12K1,0402,1%,1/16W; Manufacturer_Part_Number: RC0402FR-0712K1L; Manufacturer: YAGEO; Provided_By: SUBCO; ECCN_US: EAR99; ECCN_EU: NEC; Internal_Part_Number: MCD-00723; Status: Released; Part_Type: Resistor; Package: R0402; ComponentLink1Description: Datasheet; ComponentLink1URL: http://tunmcdsvn.tun.st.com/Component_Datasheet_Library/Trunk/Resistors/Yageo_Resistor_RC0402-series
R55-R58 = MCD-00515: Resistor,75R,0402,1%,1/16W; Manufacturer_Part_Number: RC0402FR-0775RL; Manufacturer: YAGEO; Provided_By: SUBCO; ECCN_US: EAR99; ECCN_EU: NEC; Internal_Part_Number: MCD-00515; Status: Released; Part_Type: Resistor; Package: R0402; ComponentLink1Description: Datasheet; ComponentLink1URL: http://tunmcdsvn.tun.st.com/Component_Datasheet_Library/Trunk/Resistors/Yageo_Resistor_RC0402-series
R61 R62 = MCD-00441: Resistor,270R,0402,1%,1/16W; Manufacturer_Part_Number: RC0402FR-07270RL; Manufacturer: YAGEO; Provided_By: SUBCO; ECCN_US: EAR99; ECCN_EU: NEC; Internal_Part_Number: MCD-00441; Status: Released; Part_Type: Resistor; Package: R0402; ComponentLink1Description: Datasheet; ComponentLink1URL: http://tunmcdsvn.tun.st.com/Component_Datasheet_Library/Trunk/Resistors/Yageo_Resistor_RC0402-series
R78-R81 = MCD-00565: Resistor,49R9,0402,1%,1/16W; Manufacturer_Part_Number: RC0402FR-0749R9L; Manufacturer: YAGEO; Provided_By: SUBCO; ECCN_US: EAR99; ECCN_EU: NEC; Internal_Part_Number: MCD-00565; Status: Released; Part_Type: Resistor; Package: R0402; ComponentLink1Description: Datasheet; ComponentLink1URL: http://tunmcdsvn.tun.st.com/Component_Datasheet_Library/Trunk/Resistors/Yageo_Resistor_RC0402-series
SB98 SB101 SB102 = MCD-00071: Solder Bridge ON; Part_Type: Mechanical; Manufacturer_Part_Number: RC0603JR-070RL; Manufacturer: YAGEO; Provided_By: SUBCO; Internal_Part_Number: MCD-00071; Status: Released; ComponentLink1Description: Datasheet; Package: SB0603; ComponentLink1URL: http://tunmcdsvn.tun.st.com/Component_Datasheet_Library/Trunk/Resistors/Yageo_Resistor_RC0603-series; ECCN_US: n/a; ECCN_EU: n/a
U15#1 = MCD-00719: 10/100M RMII Ethernet transceiver; Part_Type: IC; Manufacturer: MICROCHIP; Provided_By: SUBCO; Internal_Part_Number: MCD-00719; Value: LAN8742A-CZ-TR; Status: Released; Manufacturer_Part_Number: LAN8742A-CZ-TR; ComponentLink1Description: Datasheet; ComponentLink1URL: http://tunmcdsvn.tun.st.com/Component_Datasheet_Library/Trunk/IC/MICROCHIP_LAN8742A_RMII_PHY; ECCN_US: n/a; ECCN_EU: n/a
U16 = MCD-00250: Very low capacitance ESD protection , 4 lines; Part_Type: IC; Manufacturer: STMICROELECTRONICS; BMS_Part_Number: 9151001; Provided_By: SUBCO with ST control; ECCN_US: EAR99; ECCN_EU: NEC; Internal_Part_Number: MCD-00250; Value: USBLC6-4SC6; Status: Released; Manufacturer_Part_Number: USBLC6-4SC6; ComponentLink1Description: Datasheet; ComponentLink1URL: http://tunmcdsvn.tun.st.com/Component_Datasheet_Library/Trunk/Diodes/STM_ESD_USBLC6-4SC6
U17 = MCD-00718: Discrete Magnetic Transformer Module, 16 pins, SMT, 100 Base-TX; Part_Type: IC; Manufacturer: DONGGUAN KEYOUDA ELECTRONIC TECHNOLOGY; Provided_By: SUBCO; Internal_Part_Number: MCD-00718; Value: KMS-1102NL; Status: Released; Manufacturer_Part_Number: KMS-1102NL; ComponentLink1Description: Datasheet; ComponentLink1URL: http://tunmcdsvn.tun.st.com/Component_Datasheet_Library/Trunk/IC/DGKYD_KMS-1102NL; ECCN_US: n/a; ECCN_EU: n/a
X4 = MCD-01364: Crystal 25MHz, 6pF, +-20ppm, 80ohms max, SMD; Part_Type: Crystal_Osc; Manufacturer_Part_Number: NX2016SA 25MHz EXS00A-CS11321; Manufacturer: NDK; BMS_Part_Number: 9157044; Provided_By: SUBCO; ECCN_US: EAR99; ECCN_EU: NEC; Internal_Part_Number: MCD-01364; Status: Released; Package: NX2016SA; ComponentLink1Description: Datasheet; ComponentLink1URL: http://tunmcdsvn.tun.st.com/Component_Datasheet_Library/Trunk/Crystal_Osc/NDK_NX2016SA 25MHz EXS00A-CS11321 (EXS10B-28187); Order_Code_Digikey: 644-1367

## Sheet Copy of ST_LINK_V3E.SchDoc: STLINK_V3E
size A3; Date: Not used; ApprovedBy: Not used; CheckedBy: Not used; Author: Not used; CompanyName: STMicroelectronics; DrawnBy: Not used; Engineer: Not used; Organization: Not used; Address1: Not used; Address2: Not used; Address3: Not used; Address4: Not used; DocumentNumber: 10; Revision: Not used; SheetNumber: 9; SheetTotal: 9; CurrentTime: Not used; CurrentDate: Not used; Time: Not used; DocumentFullPathAndName: Not used; DocumentName: Not used; ModifiedDate: Not used; ImagePath: Not used; ProjectName: Not used; Application_BuildNumber: Not used
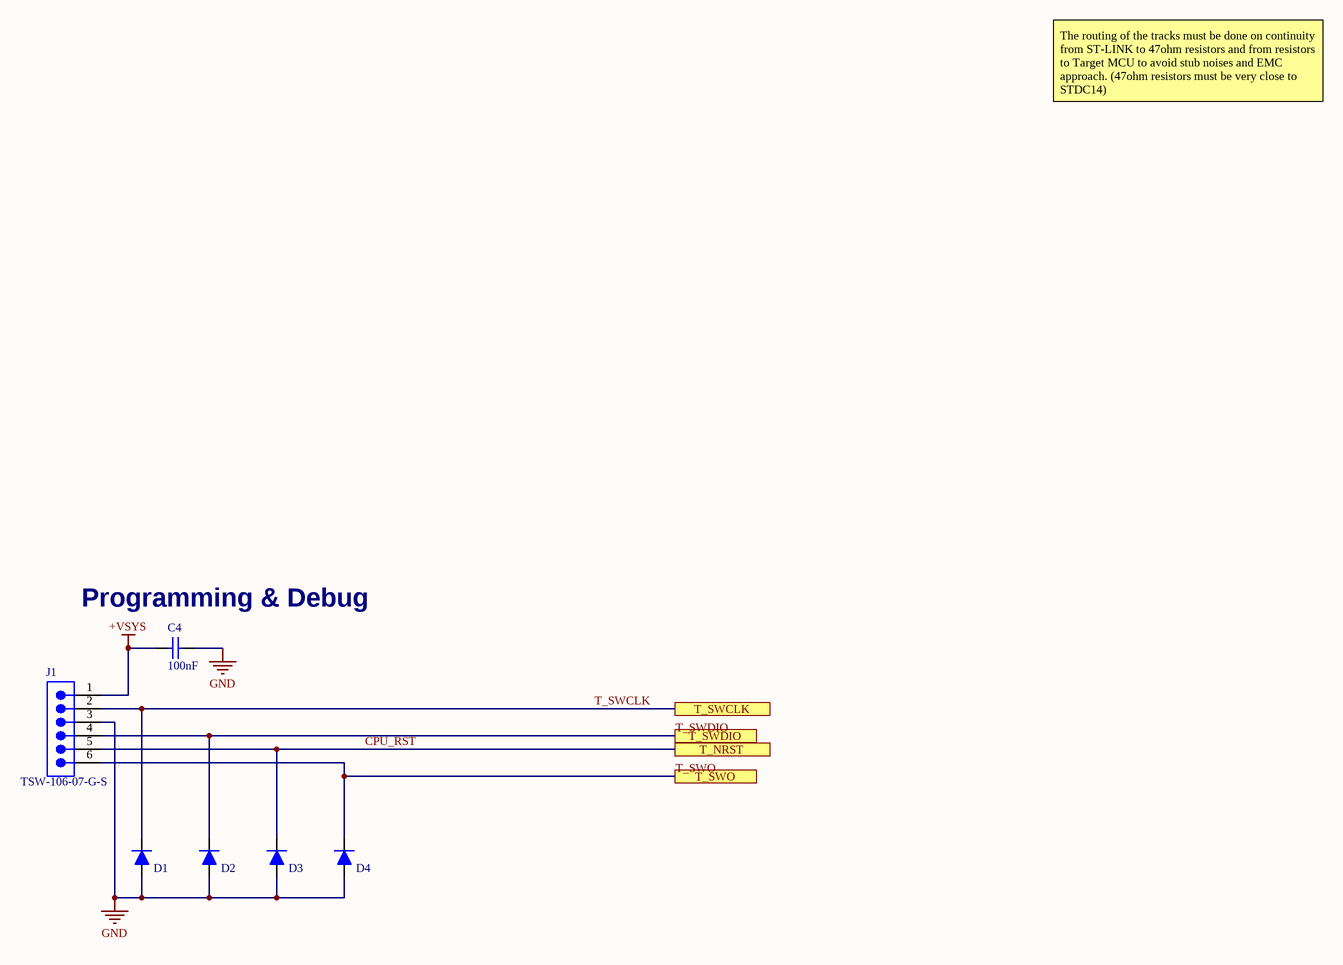
[diagram p8: Copy of ST_LINK_V3E.SchDoc]

### Parts
C4  100nF  [0402]
D1  CG0603MLC-3.3LE  [ESD PROTECTOR]  (value not drawn)
D2  CG0603MLC-3.3LE  [ESD PROTECTOR]  (value not drawn)
D3  CG0603MLC-3.3LE  [ESD PROTECTOR]  (value not drawn)
D4  CG0603MLC-3.3LE  [ESD PROTECTOR]  (value not drawn)
J1  TSW-106-07-G-S  [SMTC-TSW-106-07-X-S]

### Ports
T_NRST, T_SWCLK, T_SWDIO, T_SWO

### Nets
+VSYS: C4.1 J1.1
GND: C4.2 D1.2(A) D2.2(A) D3.2(A) D4.2(A) J1.3
CPU_RST: D3.1(K) J1.5 ; port T_NRST
T_SWCLK: D1.1(K) J1.2 ; port T_SWCLK  [project net PA14]
T_SWDIO: D2.1(K) J1.4 ; port T_SWDIO  [project net PA13]
T_SWO: D4.1(K) J1.6 ; port T_SWO

### Notes on the sheet
- The routing of the tracks must be done on continuity from ST-LINK to 47ohm resistors and from resistors to Target MCU to avoid stub noises and EMC approach. (47ohm resistors must be very close to STDC14)
- (near C4) Programming & Debug
- Title:
- Project:
- Size:
- Revision:
- Variant:
- A3
- -
- Date:
- Reference:
- Sheet:
- of

### Library data of the parts
C4 = 04025D104KAT2A: 0402 (1005Metric) CERAMIC CAPACITOR ceramic capacitor 50V 0.1muF ±10% X5R; Manufacturer: Kyocera AVX; Material: 4241ConductorMaterial; Supplier 1: Arrow Electronics; Manufacturer Part Number: 04025D104KAT2A; RoHS: Yes; Category: Ceramic Capacitors; Stock 1: 10000; Pricing 1: 10000=0,008, 20000=0,007, 30000=0,0069, 100000=0,006, 150000=0,0059 (USD); Mounting Technology: Surface Mount; Case/Package: 0402; Case Code (Imperial): 0402; Case Code (Metric): 1005; Min Operating Temperature: -55°C; Max Operating Temperature: 85°C; Value: 100nF; Series: -; Packaging: Cut Tape; Voltage Rating: 50V; Tolerance: 10%; Voltage Rating (DC): 50V; Height: 560um; RoHS Compliant: Yes; ComponentLink1URL: https://datasheet.octopart.com/04025D104KAT2A-KYOCERA-AVX-datasheet-155912759.pdf?src-supplier=Future+Electronics; ComponentLink1Description: https://datasheet.octopart.com/04025D104KAT2A-KYOCERA-AVX-datasheet-155912759.pdf?src-supplier=Future+Electronics; ComponentLink2URL: http://datasheets.avx.com/cx5r.pdf?src-supplier=Digikey; ComponentLink2Description: http://datasheets.avx.com/cx5r.pdf?src-supplier=Digikey
D1-D4 = CG0603MLC-3.3LE: MLC Series Multilayer Varistor 0.5pF; Clamping 25V 0603 Case; Manufacturer: Bourns; Voltage Rating (DC): 3.3V; Number of Circuits: 1; Current Rating: 5nA; Element Configuration: Single; RoHS 1: Yes; Category: Varistors; Stock 1: 105939; Pricing 1: 1=0,37000, 10=0,29900, 25=0,27360, 100=0,20360, 250=0,18452, 500=0,15272, 1000=0,11453, 2500=0,10499 (USD); Mount: Surface Mount; Case/Package: 0603; Number of Pins: 2; Case Code (Metric): 1608; Case Code (Imperial): 0603; Contact Plating: Tin; Min Operating Temperature: -40°C; Max Operating Temperature: 85°C; Package Quantity: 5000; Capacitance: 0.5pF; Packaging: Tape and Reel; Operating Supply Voltage: 3.3V; Max Voltage Rating (DC): 3.3V; Number of Channels: 1; Clamping Voltage: 25V; Termination: SMD/SMT; Voltage: 3.3V; Working Voltage: 3.3V; Leakage Current: 5nA; Series: MLC; Length: 1.6mm; Width: 0.8mm; Depth: 0.8mm; Radiation Hardening: No; Reach SVHC Compliant: Yes; RoHS Compliant: Yes; ComponentLink1URL: https://datasheet.ciiva.com/366/mlc-366192.pdf?src-supplier=Digi-Key; ComponentLink1Description: https://datasheet.ciiva.com/366/mlc-366192.pdf?src-supplier=Digi-Key; ComponentLink2URL: https://datasheet.ciiva.com/11834/0900766b80dbb952-11834610.pdf?src-supplier=RSComponents; ComponentLink2Description: https://datasheet.ciiva.com/11834/0900766b80dbb952-11834610.pdf?src-supplier=RSComponents; ComponentLink3URL: https://datasheet.ciiva.com/366/mlc-366190.pdf?src-supplier=Digi-Key; ComponentLink3Description: https://datasheet.ciiva.com/366/mlc-366190.pdf?src-supplier=Digi-Key; ComponentLink4URL: https://datasheet.ciiva.com/366/mlc-366191.pdf?src-supplier=Digi-Key; ComponentLink4Description: https://datasheet.ciiva.com/366/mlc-366191.pdf?src-supplier=Digi-Key; ComponentLink5URL: https://datasheet.ciiva.com/10437/mlc-10437033.pdf?src-supplier=Avnet; ComponentLink5Description: https://datasheet.ciiva.com/10437/mlc-10437033.pdf?src-supplier=Avnet; ComponentLink6URL: https://datasheet.ciiva.com/46435/1785244-46435096.pdf?src-supplier=Element14; ComponentLink6Description: https://datasheet.ciiva.com/46435/1785244-46435096.pdf?src-supplier=Element14; Supplier 1: Digi-Key; Supplier Part Number 1: CG0603MLC-3.3LECT-ND; Manufacturer Part Number 1: CG0603MLC-3.3LE
J1 = CMP-1024-00383-1: 0.025" SQ Post Header, Through-hole, Vertical, -55 to 125 degC, 2.54 mm Pitch, 6-Pin, Male, RoHS; Manufacturer: Samtec; Pitch: 2.54 mm; RoHS: True; ComponentLink1Description: Manufacturer URL; DatasheetVersion: F-214; Orientation: Vertical; ComponentLink1URL: http://www.samtec.com; ComponentLink3Description: Package Specification; ComponentLink2Description: Datasheet; PackageVersion: DM, 8/1988; PackageDescription: .025[0.64] SQ. Post Terminal Strip Assembly; PackageReference: TSW-106-07-X-S; Mounting Technology: Through-hole; Temperature Range: -55 to 125 degC; ComponentLink3URL: http://www.samtec.com/documents/webfiles/cpdf/TSW-XXX-XX-XXX-X-XX-XXX-MKT.pdf; ComponentLink2URL: http://www.samtec.com/documents/webfiles/pdf/TSW_TH.PDF; PartNumber: TSW-106-07-G-S

## Sheet CAN_TJA1050_Page1.SchDoc
size A4
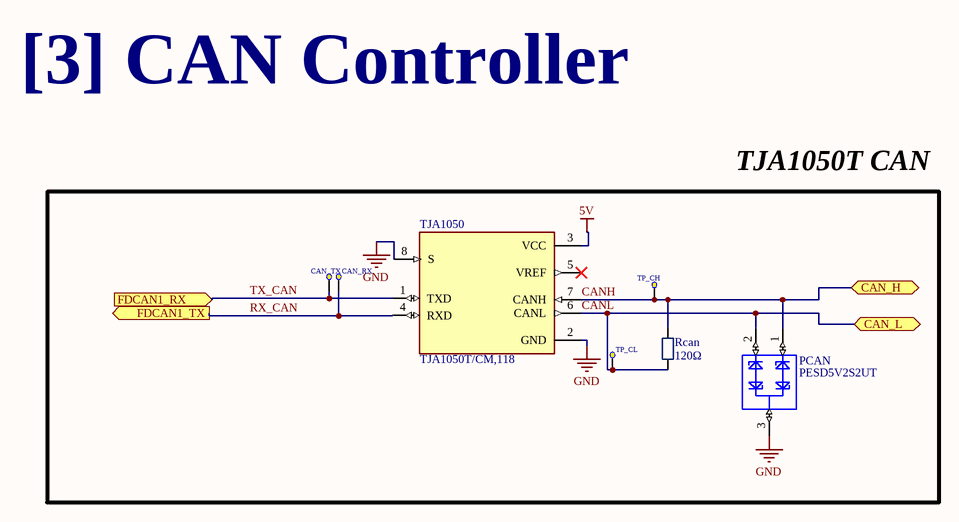
[diagram p9: CAN_TJA1050_Page1.SchDoc]

### Parts
CAN_RX  (no value)  [TestPoint]  (no BOM)
CAN_TX  (no value)  [TestPoint]  (no BOM)
PCAN  PESD5V2S2UT  [PEDS1CAN]
Rcan  120Ω  [Resistor_0805_Generic]
TJA1050  TJA1050T/CM,118  [TJA1050T]
TP_CH  (no value)  [TestPoint]  (no BOM)
TP_CL  (no value)  [TestPoint]  (no BOM)

### Blocks framed on the sheet
TJA1050T CAN: CAN_RX CAN_TX PCAN Rcan TJA1050 TP_CH TP_CL

### Ports
CAN_H (bidir), CAN_L (bidir), FDCAN1_RX (in), FDCAN1_TX (out)

### Nets
5V: TJA1050.3(VCC)
GND: PCAN.3 TJA1050.2(GND) TJA1050.8(S)
CANH: PCAN.1 Rcan.2 TJA1050.7(CANH) TP_CH.1(Test_Point) ; port CAN_H
CANL: PCAN.2 Rcan.1 TJA1050.6(CANL) TP_CL.1(Test_Point) ; port CAN_L
RX_CAN: CAN_RX.1(Test_Point) TJA1050.4(RXD) ; port FDCAN1_TX  [project net PD1]
TX_CAN: CAN_TX.1(Test_Point) TJA1050.1(TXD) ; port FDCAN1_RX  [project net PD0]

Not connected (* = marked no-connect by the designer): TJA1050 5(VREF)*

### Notes on the sheet
- [3] CAN Controller

### Library data of the parts
CAN_RX CAN_TX TP_CH TP_CL = TestPoint
PCAN = PESDCAN: ESD Protection Diodes / TVS Diodes PESD5V2S2UT/SOT23/TO-236AB; MF: Nexperia USA; MP: PESD1CAN; Availability: Unavailable; SnapEDA_Link: https://www.snapeda.com/parts/PESD1CAN/Nexperia%20USA%20Inc./view-part/2164340/?ref=snap; Price: None; Package: SOT-323 Nexperia USA; Value: *
Rcan = Resistor_0805: 120Ω +-0.5%; 400V; 0805
TJA1050 = TJA1050T/CM,118: 1/1 Transceiver Half CANbus 8-SO; MF: NXP USA; SnapEDA_Link: https://www.snapeda.com/parts/TJA1050T/CM,118/NXP%20USA%20Inc./view-part/304529/?ref=snap; Value: *; Purchase-URL: https://pricing.snapeda.com/search/part/TJA1050T/CM,118/?ref=eda; Check_prices: https://www.snapeda.com/parts/TJA1050T/CM,118/NXP%20USA%20Inc./view-part/304529/?ref=eda; Price: None; Availability: In Stock; MP: TJA1050T/CM,118; Package: SO-8 NXP Semiconductors

## Sheet 12V_Regulator.SchDoc
size A4
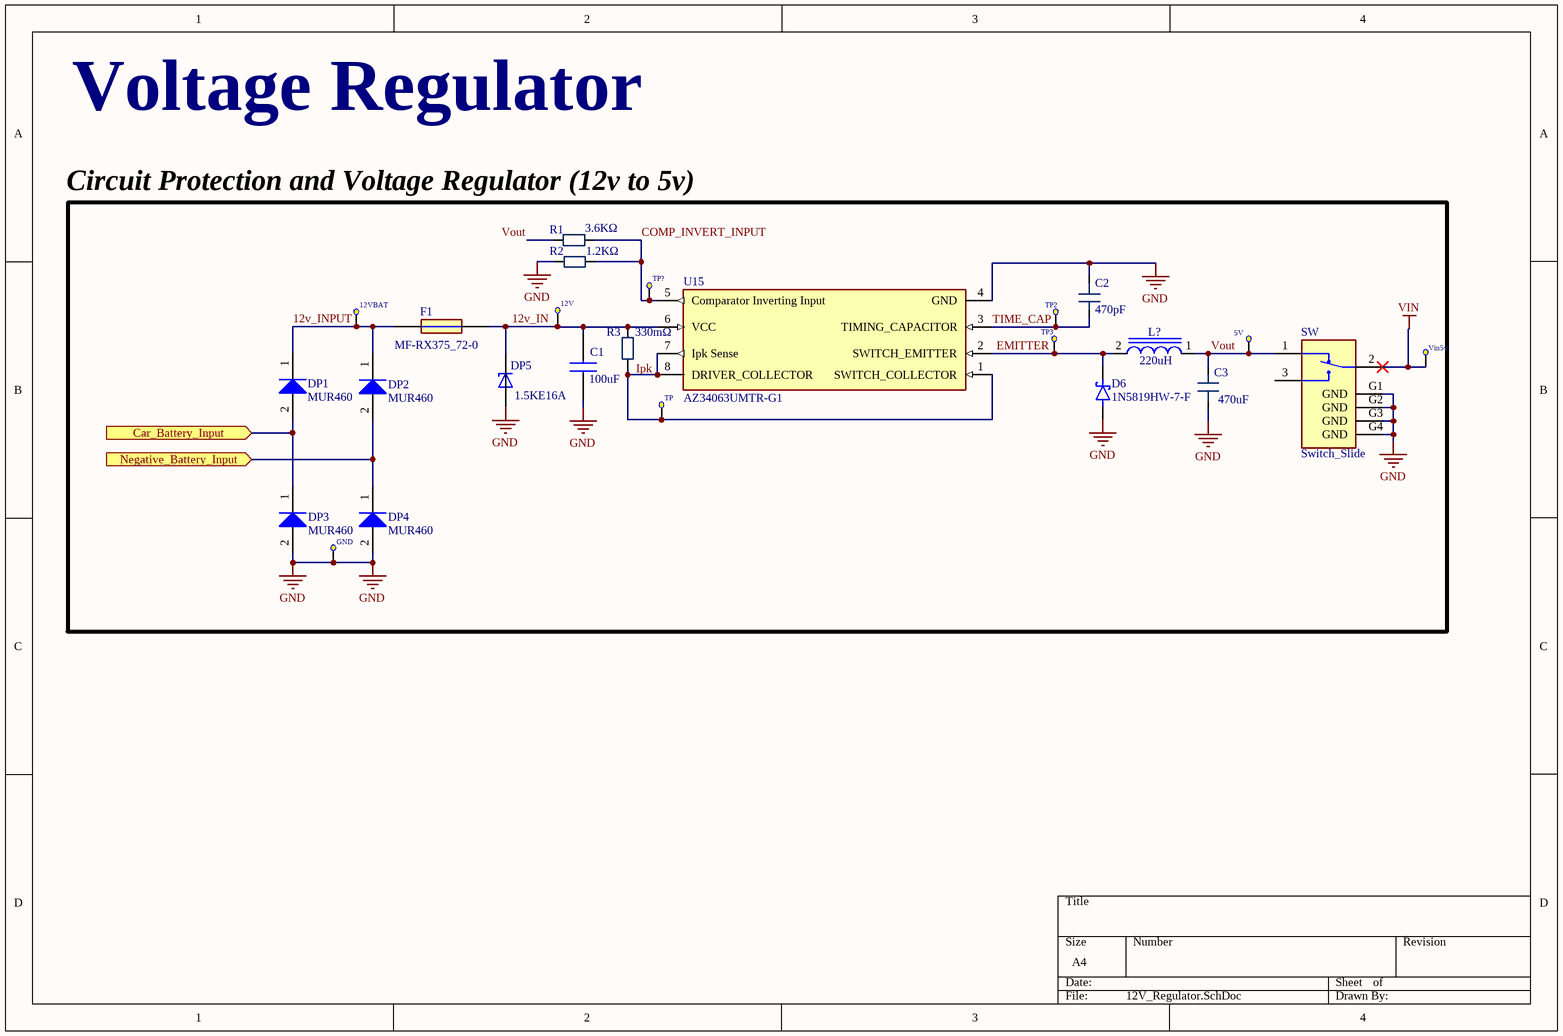
[diagram p10: 12V_Regulator.SchDoc]

### Parts
(Parts that share a designator on the sheet are numbered #1, #2 ... from top to bottom, then left to right.)
5V  (no value)  [TestPoint]  (no BOM)
12V  (no value)  [TestPoint]  (no BOM)
12VBAT  (no value)  [TestPoint]  (no BOM)
C1  100uF  [CAP_100uF]
C2  470pF  [Capacitor_SMD_0805_Generic]
C3  470uF  [Capacitor_470uF]
D6  1N5819HW-7-F  [1N5819HW-7-F]
DP1  MUR460  [ONSC-AXIAL_LEAD-2-267-05_V]
DP2  MUR460  [ONSC-AXIAL_LEAD-2-267-05_V]
DP3  MUR460  [ONSC-AXIAL_LEAD-2-267-05_V]
DP4  MUR460  [ONSC-AXIAL_LEAD-2-267-05_V]
DP5  1.5KE16A  [DIOAD1586W101L900D530]
F1  MF-RX375_72-0  [MFRX375720]
GND  (no value)  [TestPoint]  (no BOM)
L?  220uH  [INDP125125X600N]
R1  3.6KΩ  [Resistor_0805_Generic]
R2  1.2KΩ  [Resistor_0805_Generic]
R3  330mΩ  [Resistor_0805_Generic]
SW  Switch_Slide  [Switch_Slide]
TP  (no value)  [TestPoint]  (no BOM)
TP2  (no value)  [TestPoint]  (no BOM)
TP3  (no value)  [TestPoint]  (no BOM)
TP?  (no value)  [TestPoint]  (no BOM)
U15#2  AZ34063UMTR-G1  [AZ34063UMTR-G1]
Vin5v  (no value)  [TestPoint]  (no BOM)

### Blocks framed on the sheet
Circuit Protection and Voltage Regulator (12v to 5v): 5V 12V 12VBAT C1-C3 D6 DP1-DP5 F1 GND L? R1-R3 SW TP TP2 TP3 TP? U15#2 Vin5v

### Ports
Car_Battery_Input (in), Negative_Battery_Input (in)

### Nets
GND: C1.1 C2.2 C3.2 D6.A DP3.2(A) DP4.2(A) DP5.A GND.1(Test_Point) R2.2 SW.G1(GND) SW.G2(GND) SW.G3(GND) SW.G4(GND) U15#2.4(GND)
VIN: SW.2 Vin5v.1(Test_Point)
12v_IN: 12V.1(Test_Point) C1.2 DP5.C F1.2 R3.2 U15#2.6(VCC)
12v_INPUT: 12VBAT.1(Test_Point) DP1.1(K) DP2.1(K) F1.1
Car_Battery_Input: DP1.2(A) DP3.1(K) ; port Car_Battery_Input
COMP_INVERT_INPUT: R1.1 R2.1 TP?.1(Test_Point) U15#2.5(Comparator_Inverting_Input)
EMITTER: D6.C(K) L?.2 TP3.1(Test_Point) U15#2.2(SWITCH_EMITTER)
Negative_Battery_Input: DP2.2(A) DP4.1(K) ; port Negative_Battery_Input
TIME_CAP: C2.1 TP2.1(Test_Point) U15#2.3(TIMING_CAPACITOR)
Vout: 5V.1(Test_Point) C3.1 L?.1 R1.2 SW.1
NetR3_1: R3.1 TP.1(Test_Point) U15#2.1(SWITCH_COLLECTOR) U15#2.7(Ipk_Sense) U15#2.8(DRIVER_COLLECTOR)

Not connected (* = marked no-connect by the designer): SW 3

### Notes on the sheet
- Voltage Regulator
- Labels drawn without touching a wire or pin: Ipk

### Library data of the parts
5V 12V 12VBAT GND TP TP2 TP3 TP? Vin5v = TestPoint
C1 = Cap_100uF: 100uF +/-20%;  16V; X5R; 1812; Manufacturer_Name: Kyocera AVX; Manufacturer_Part_Number: 1210YD107MAT2A; Geometry.Height: 2.79mm; Mouser Part Number: 581-1210YD107MAT2A; Mouser Price/Stock: https://www.mouser.co.uk/ProductDetail/KYOCERA-AVX/1210YD107MAT2A?qs=dTuOkNN7mNJArH0RUYK6ig%3D%3D; Datasheet Link: https://datasheet.datasheetarchive.com/originals/distributors/DKDS40/DSANUWW008853.pdf
C2 = Capacitor_0805_Generic: 470pF +/-10%;  200V; X7R; 0805
C3 = Capacitor_0805_Generic
D6 = 1N5819HW-7-F: Diode Schottky 40 V 1A Surface Mount SOD-123; MF: Diodes Inc.; Value: *; SnapEDA_Link: https://www.snapeda.com/parts/1N5819HW-7-F/Diodes+Inc./view-part/?ref=snap; Purchase-URL: https://pricing.snapeda.com/search/part/1N5819HW-7-F/?ref=eda; Availability: In Stock; Price: None; Package: SOD-123 Fairchild Semiconductor; Check_prices: https://www.snapeda.com/parts/1N5819HW-7-F/Diodes+Inc./view-part/?ref=eda; MP: 1N5819HW-7-F
DP1-DP4 = CMP-0902-00067-1: MUR460 Power Rectifier, 2-Pin Axial_Lead, Pb-Free, Bulk Bag; Manufacturer: On Semiconductor; IFSM Max (A): 110; VRRM Max (V): 600; DatasheetVersion: Rev. 15; ComponentLink1URL: http://www.onsemi.com/; ComponentLink2URL: http://www.onsemi.cn/pub_link/Collateral/MUR420-D.PDF; Mounting Technology: Through Hole; ComponentLink1Description: Manufacturer URL; ComponentLink2Description: Datasheet; Type: Ultrafast; PackageDescription: 2-Pin, Axial Lead, Diameter 5.05 mm; PartNumber: MUR460; PackageVersion: Rev. G, 06/2000; PackageReference: AXIAL_LEAD-2-267-05; Packing: Bulk Bag; RoHS: TRUE; ComponentLink3URL: http://www.onsemi.com/pub_link/Collateral/267-05.PDF; ComponentLink3Description: Package Specification
DP5 = 1.5KE16A: ESD Protection Diodes/TVS Diodes 1500W 13.6V Uni-Directional; Package: None; Price: None; Value: *; MP: 1.5KE16A; Availability: Unavailable
F1 = MF-RX375_72-0_1: Bourns 3.75A Radial Leaded PCB Mount Resettable Fuse, 72 V; Manufacturer_Part_Number: MF-RX375/72-0; Geometry.Height: 29.51mm; Manufacturer_Name: Bourns; Mouser Part Number: 652-MF-RX375/72-0; Mouser Price/Stock: https://www.mouser.co.uk/ProductDetail/Bourns/MF-RX375-72-0?qs=9FzDyaD7ZFD00YfbCcBudg%3D%3D; Arrow Part Number: MF-RX375/72-0; Arrow Price/Stock: https://www.arrow.com/en/products/mf-rx37572-0/bourns?utm_currency=USD&region=europe; Datasheet Link: https://componentsearchengine.com/Datasheets/2/MF-RX375_72-0.pdf
L? = SRR1260-680M: 68ÂµH Shielded Wirewound Inductor 2.1A 110mOhm Max Nonstandard; MF: Bourns; Package: Nonstandard Bourns; Value: *; Digi-Key_Purchase_URL: https://www.digikey.com/product-detail/en/bourns-inc/SRR1260-680M/SRR1260-680MCT-ND/2127423?utm_source=snapeda&utm_medium=aggregator&utm_campaign=symbol; Digi-Key_Part_Number: SRR1260-680MCT-ND; SnapEDA_Link: https://www.snapeda.com/parts/SRR1260-680M/Bourns/view-part/337191/?ref=snap; MP: SRR1260-680M
R1 = Resistor_0805: 3.6KΩ +-0.5%; 400V; 0805
R2 = Resistor_0805: 1.2KΩ +-1%; 75V; 0805
R3 = Resistor_0805: 330mΩ +-1%; 150V; 0805
SW = Switch_Slide: Switch Slide SPDT Side Slide 0.3A 4VDC Gull Wing SMD Box; MP: MLL1200S; Package: None; Availability: Unavailable; Value: *; Price: None
U15#2 = AZ34063UMTR-G1: Switching Voltage Regulators 1.5A Step-Down/Up 3.0V to 36V 180kHz

## Nets that join several sheets
3V3: Copy of Connectors (R26.2 R27.2 R28.2), Copy of Power_Board (C39.2 TP1.1 U11.4 U11.5), Copy of MCU_144_IOs (B1.1 B1.2 R37.2), Copy of MCU_144_POWER (31 pins), USB (R59.2 R64.2 R68.2 R69.2), Ethernet (8 pins)
5V: Copy of Connectors (J2.1), Copy of Power_Board (7 pins), USB (U18.5), CAN_TJA1050_Page1 (TJA1050.3)
GND: Copy of Connectors (8 pins), Copy of Power_Board (9 pins), Copy of MCU_144_IOs (15 pins), Copy of MCU_144_POWER (39 pins), USB (13 pins), Ethernet (22 pins), Copy of ST_LINK_V3E (6 pins), CAN_TJA1050_Page1 (PCAN.3 TJA1050.2 TJA1050.8), 12V_Regulator (14 pins)
VIN: Copy of Power_Board (C42.2 U12.3), 12V_Regulator (SW.2 Vin5v.1)
CANH: Copy of Connectors (CAN.1), CAN_TJA1050_Page1 (PCAN.1 Rcan.2 TJA1050.7 TP_CH.1)
CANL: Copy of Connectors (CAN.2), CAN_TJA1050_Page1 (PCAN.2 Rcan.1 TJA1050.6 TP_CL.1)
Car_Battery_Input: Copy of Connectors (PWR.1), 12V_Regulator (DP1.2 DP3.1)
CPU_RST: Copy of MCU_144_IOs (5 pins), Ethernet (SB98.1), Copy of ST_LINK_V3E (D3.1 J1.5)
Negative_Battery_Input: Copy of Connectors (PWR.2), 12V_Regulator (DP2.2 DP4.1)
PA5: Copy of Connectors (J2.5 SB65.1), Copy of MCU_144_IOs (U14.44)
PA6: Copy of Connectors (J2.4), Copy of MCU_144_IOs (U14.45)
PA13: Copy of MCU_144_IOs (U14.102), Copy of ST_LINK_V3E (D2.1 J1.4)
PA14: Copy of MCU_144_IOs (U14.107), Copy of ST_LINK_V3E (D1.1 J1.2)
PB0: Copy of Connectors (SB54.1), Copy of MCU_144_IOs (U14.49)
PB5: Copy of Connectors (J2.3), Copy of MCU_144_IOs (U14.132)
PB10: Copy of Connectors (SERIAL.3), Copy of MCU_144_IOs (U14.66)
PB11: Copy of Connectors (SERIAL.2), Copy of MCU_144_IOs (U14.67)
PB14: Copy of Connectors (R75.1), Copy of MCU_144_IOs (U14.74)
PD0: Copy of MCU_144_IOs (U14.112), CAN_TJA1050_Page1 (CAN_TX.1 TJA1050.1)
PD1: Copy of MCU_144_IOs (U14.113), CAN_TJA1050_Page1 (CAN_RX.1 TJA1050.4)
PE1: Copy of Connectors (R74.1), Copy of MCU_144_IOs (U14.139)
RMII_CRS_DV: Copy of MCU_144_IOs (SB52.2), Ethernet (R44.1)
RMII_MDC: Copy of MCU_144_IOs (SB84.1), Ethernet (U15#1.13)
RMII_MDIO: Copy of MCU_144_IOs (JP7.1), Ethernet (R50.1 U15#1.12)
RMII_REF_CLK: Copy of MCU_144_IOs (SB80.2), Ethernet (R52.1)
RMII_RXD0: Copy of MCU_144_IOs (SB63.1), Ethernet (R47.1)
RMII_RXD1: Copy of MCU_144_IOs (SB48.1), Ethernet (R48.1)
RMII_TX_EN: Copy of MCU_144_IOs (SB36.1), Ethernet (U15#1.16)
RMII_TXD0: Copy of MCU_144_IOs (SB46.1), Ethernet (U15#1.17)
RMII_TXD1: Copy of MCU_144_IOs (JP6.2), Ethernet (U15#1.18)
T_SWO: Copy of MCU_144_IOs (SB50.1), Copy of ST_LINK_V3E (D4.1 J1.6)
USB_FS_ID: Copy of MCU_144_IOs (SB29.2), USB (CN13.4 U22.1)
USB_FS_N: Copy of MCU_144_IOs (SB26.2), USB (U19.1)
USB_FS_OVCR: Copy of MCU_144_IOs (SB100.1), USB (LD7.2 R64.1 U18.3)
USB_FS_P: Copy of MCU_144_IOs (SB27.2), USB (U19.3)
USB_FS_PWR_EN: Copy of MCU_144_IOs (JP8.1 SB91.2), USB (R59.1 U18.4)
USB_FS_VBUS: Copy of MCU_144_IOs (R63.1), USB (5 pins)

## Assembly variants
H745ZIQ: all parts fitted
H755ZIQ: all parts fitted
H7A3ZIQ: all parts fitted
SEGCOM: all parts fitted